# EAGLE design GTOledscapeV0.4 (EAGLE 8.0.0)
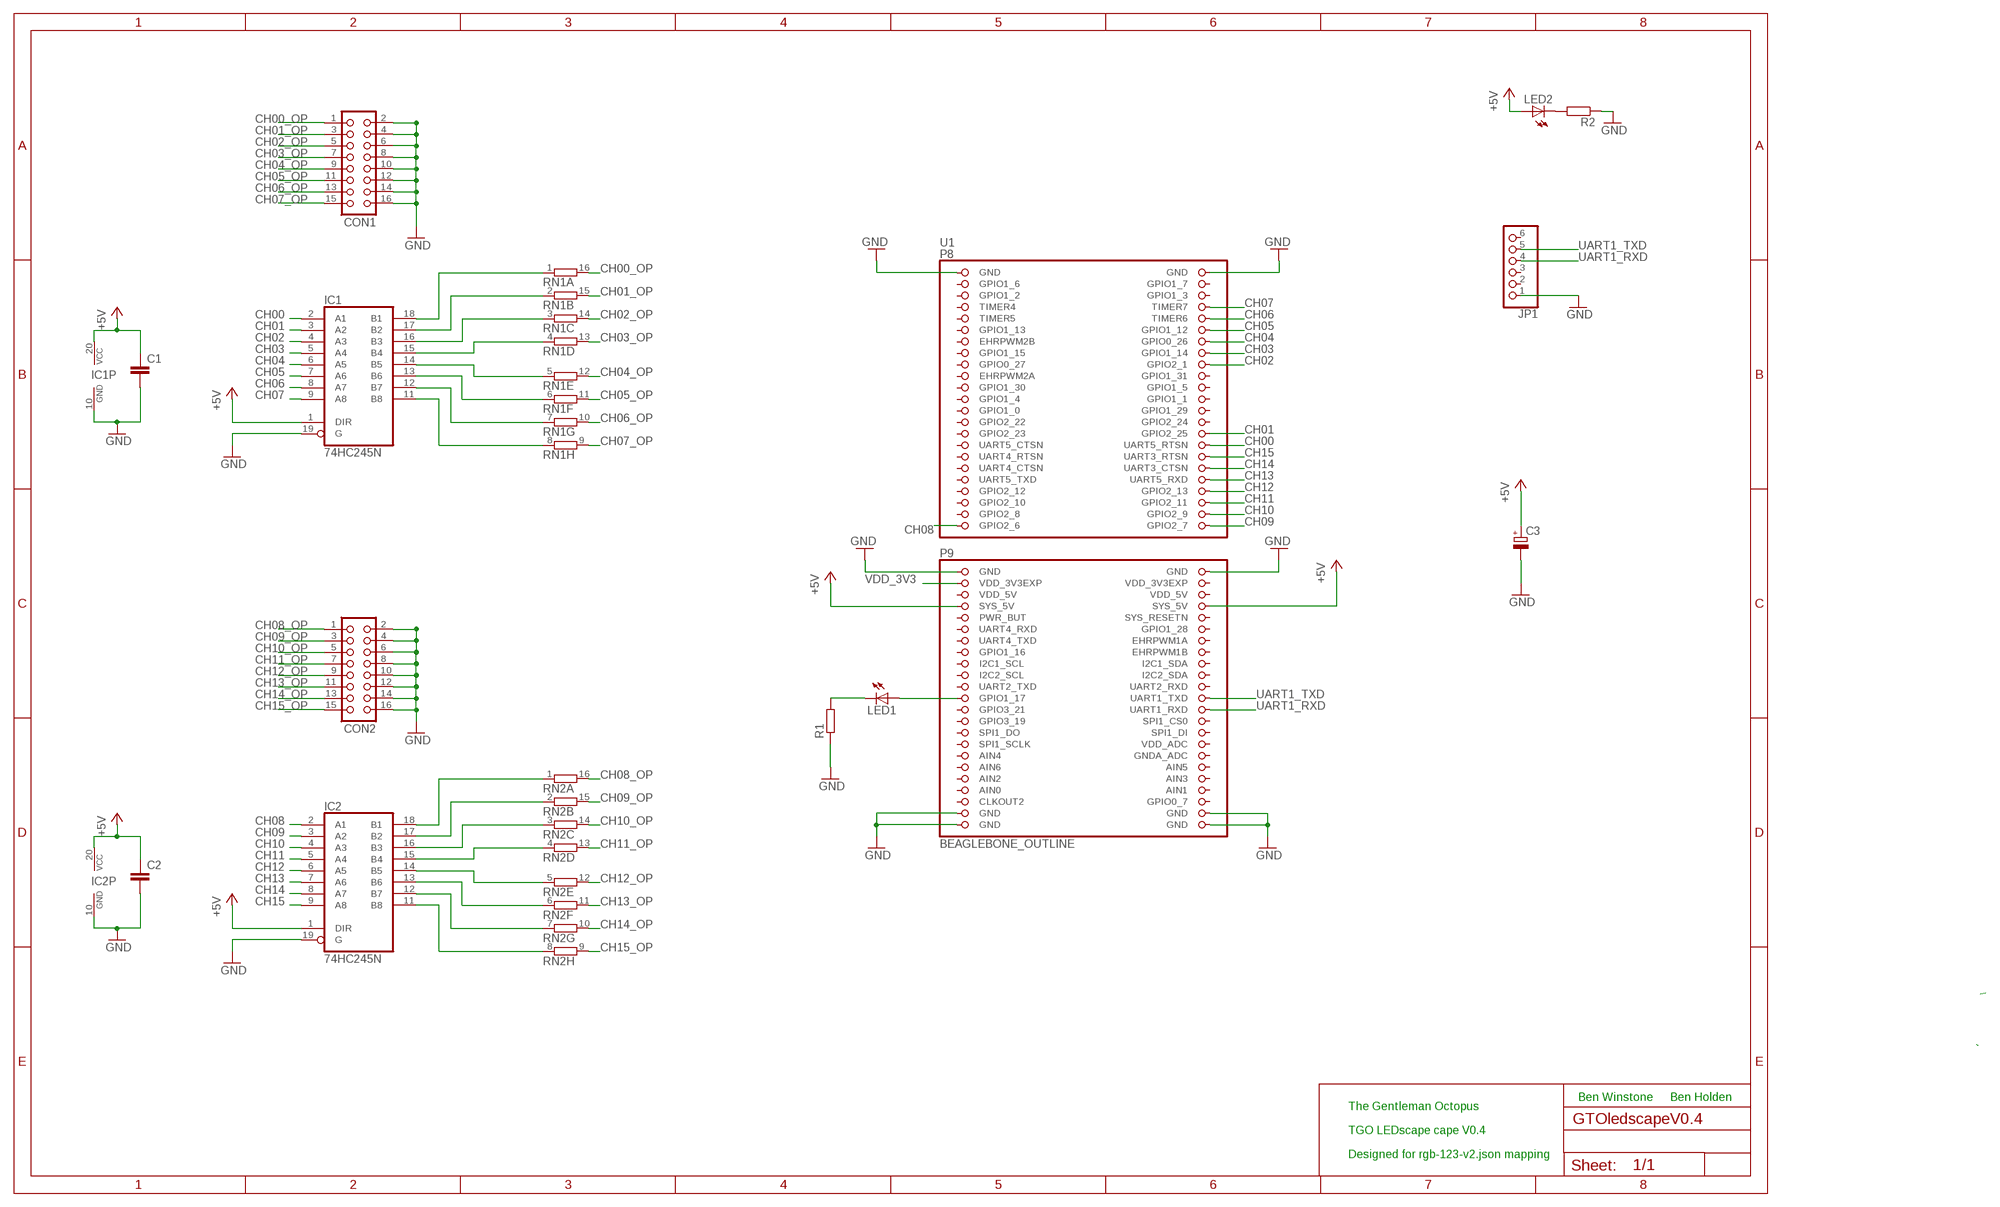
[diagram p0: schematic, sheet 1]

## Parts
C1  C-EU050-045X075  [C050-045X075]
C2  C-EU050-045X075  [C050-045X075]
C3  CPOL-EUE2.5-7  [E2,5-7]
CON1  CON16  [CON16]
CON2  CON16  [CON16]
IC1  74HC245N  [DIL20]
IC2  74HC245N  [DIL20]
JP1  PINHD-1X6  [1X06]
LED1  LED3MM  [LED3MM]
LED2  LED3MM  [LED3MM]
R1  R-EU_0204/5  [0204/5]
R2  R-EU_0204/5  [0204/5]
RN1  8R-N  [DIL16]
RN2  8R-N  [DIL16]
U1  BEAGLEBONE_OUTLINE  [BEAGLEBONE_SHIELD]

## Nets
+5V: C1.1 C2.1 C3.+ IC1.1(DIR) IC1.20(VCC) IC2.1(DIR) IC2.20(VCC) LED2.A U1.53(SYS_5V) U1.54(SYS_5V)
CH00: IC1.2(A1) U1.32(UART5_RTSN)
CH00_OP: CON1.1 RN1.16
CH01: IC1.3(A2) U1.30(GPIO2_25)
CH01_OP: CON1.3 RN1.15
CH02: IC1.4(A3) U1.18(GPIO2_1)
CH02_OP: CON1.5 RN1.14
CH03: IC1.5(A4) U1.16(GPIO1_14)
CH03_OP: CON1.7 RN1.13
CH04: IC1.6(A5) U1.14(GPIO0_26)
CH04_OP: CON1.9 RN1.12
CH05: IC1.7(A6) U1.12(GPIO1_12)
CH05_OP: CON1.11 RN1.11
CH06: IC1.8(A7) U1.10(TIMER6)
CH06_OP: CON1.13 RN1.10
CH07: IC1.9(A8) U1.8(TIMER7)
CH07_OP: CON1.15 RN1.9
CH08: IC2.2(A1) U1.45(GPIO2_6)
CH08_OP: CON2.1 RN2.16
CH09: IC2.3(A2) U1.46(GPIO2_7)
CH09_OP: CON2.3 RN2.15
CH10: IC2.4(A3) U1.44(GPIO2_9)
CH10_OP: CON2.5 RN2.14
CH11: IC2.5(A4) U1.42(GPIO2_11)
CH11_OP: CON2.7 RN2.13
CH12: IC2.6(A5) U1.40(GPIO2_13)
CH12_OP: CON2.9 RN2.12
CH13: IC2.7(A6) U1.38(UART5_RXD)
CH13_OP: CON2.11 RN2.11
CH14: IC2.8(A7) U1.36(UART3_CTSN)
CH14_OP: CON2.13 RN2.10
CH15: IC2.9(A8) U1.34(UART3_RTSN)
CH15_OP: CON2.15 RN2.9
GND: C1.2 C2.2 C3.- CON1.2 CON1.4 CON1.6 CON1.8 CON1.10 CON1.12 CON1.14 CON1.16 CON2.2 CON2.4 CON2.6 CON2.8 CON2.10 CON2.12 CON2.14 CON2.16 IC1.10(GND) IC1.19(G) IC2.10(GND) IC2.19(G) JP1.1 R1.1 R2.1 U1.1(GND) U1.2(GND) U1.47(GND) U1.48(GND) U1.89(GND) U1.90(GND) U1.91(GND) U1.92(GND)
N$1: IC2.18(B1) RN2.1
N$2: LED2.K(C) R2.2
N$3: LED1.K(C) R1.2
N$4: LED1.A U1.69(GPIO1_17)
N$6: IC2.17(B2) RN2.2
N$7: IC1.18(B1) RN1.1
N$10: IC1.17(B2) RN1.2
N$11: IC1.16(B3) RN1.3
N$12: IC1.15(B4) RN1.4
N$13: IC1.14(B5) RN1.5
N$14: IC1.13(B6) RN1.6
N$15: IC2.16(B3) RN2.3
N$16: IC2.15(B4) RN2.4
N$17: IC2.14(B5) RN2.5
N$18: IC2.13(B6) RN2.6
N$19: IC2.12(B7) RN2.7
N$20: IC2.11(B8) RN2.8
N$29: IC1.12(B7) RN1.7
N$30: IC1.11(B8) RN1.8
UART1_RXD: JP1.4 U1.72(UART1_RXD)
UART1_TXD: JP1.5 U1.70(UART1_TXD)
VDD_3V3: U1.49(VDD_3V3EXP)
Unconnected: JP1.2 JP1.3 JP1.6 U1.3(GPIO1_6) U1.4(GPIO1_7) U1.5(GPIO1_2) U1.6(GPIO1_3) U1.7(TIMER4) U1.9(TIMER5) U1.11(GPIO1_13) U1.13(EHRPWM2B) U1.15(GPIO1_15) U1.17(GPIO0_27) U1.19(EHRPWM2A) U1.20(GPIO1_31) U1.21(GPIO1_30) U1.22(GPIO1_5) U1.23(GPIO1_4) U1.24(GPIO1_1) U1.25(GPIO1_0) U1.26(GPIO1_29) U1.27(GPIO2_22) U1.28(GPIO2_24) U1.29(GPIO2_23) U1.31(UART5_CTSN) U1.33(UART4_RTSN) U1.35(UART4_CTSN) U1.37(UART5_TXD) U1.39(GPIO2_12) U1.41(GPIO2_10) U1.43(GPIO2_8) U1.55(PWR_BUT) U1.56(SYS_RESETN) U1.57(UART4_RXD) U1.58(GPIO1_28) U1.59(UART4_TXD) U1.60(EHRPWM1A) U1.61(GPIO1_16) U1.62(EHRPWM1B) U1.63(I2C1_SCL) U1.64(I2C1_SDA) U1.65(I2C2_SCL) U1.66(I2C2_SDA) U1.67(UART2_TXD) U1.68(UART2_RXD) U1.71(GPIO3_21) U1.73(GPIO3_19) U1.74(SPI1_CS0) U1.75(SPI1_DO) U1.76(SPI1_DI) U1.77(SPI1_SCLK) U1.78(VDD_ADC) U1.79(AIN4) U1.80(GNDA_ADC) U1.81(AIN6) U1.82(AIN5) U1.83(AIN2) U1.84(AIN3) U1.86(AIN1) U1.87(CLKOUT2) U1.88(GPIO0_7)

## Notes on the sheet
- Ben Winstone | Ben Holden
- The Gentleman Octopus
  
  TGO LEDscape cape V0.4
  
  Designed for rgb-123-v2.json mapping

## Power pins joined to a net without a drawn wire
AIN0: U1.85(AIN0)
VDD_3V3EXP: U1.50(VDD_3V3EXP)
VDD_5V: U1.51(VDD_5V) U1.52(VDD_5V)

## Library data of the parts
C1 C2 = rcl:C-EU: CAPACITOR, European symbol
C3 = rcl:CPOL-EU: POLARIZED CAPACITOR, European symbol
CON1 CON2 = con-harting:CON16: CONNECTOR; OC_FARNELL: unknown; OC_NEWARK: unknown
IC1 IC2 = 74xx-eu:74*245: Octal BUS TRANSCEIVER, 3-state
JP1 = pinhead:PINHD-1X6: PIN HEADER
LED1 LED2 = led:LED: LED OSRAM: - CHIPLED LG R971, LG N971, LY N971, LG Q971, LY Q971, LO R971, LY R971 LH N974, LH R974 LS Q976, LO Q976, LY Q976 LO Q996 - Hyper CHIPLED LW Q18S LB Q993, LB Q99A, LB R99A - SideLED LS A670, LO A670, LY A670, LG A670, LP A670 LB A673, LV A673, LT A673, LW A673 LH A674 LY A675 LS A676, LA A676, LO A676, LY A676, LW A676 LS A679, LY A679, LG A679 - Hyper Micro SIDELED® LS Y876, LA Y876, LO Y876, LY Y876 LT Y87S - SmartLED LW L88C, LW L88S LB L89C, LB L89S, LG L890 LS L89K, LO L89K, LY L89K LS L896, LA L896, LO L896, LY L896 - TOPLED LS T670, LO T670, LY T670, LG T670, LP T670 LSG T670, LSP T670, LSY T670, LOP T670, LYG T670 LG T671, LOG T671, LSG T671 LB T673, LV T673, LT T673, LW T673 LH T674 LS T676, LA T676, LO T676, LY T676, LB T676, LH T676, LSB T676, LW T676 LB T67C, LV T67C, LT T67C, LS T67K, LO T67K, LY T67K, LW E67C LS E67B, LA E67B, LO E67B, LY E67B, LB E67C, LV E67C, LT E67C LW T67C LS T679, LY T679, LG T679 LS T770, LO T770, LY T770, LG T770, LP T770 LB T773, LV T773, LT T773, LW T773 LH T774 LS E675, LA E675, LY E675, LS T675 LS T776, LA T776, LO T776, LY T776, LB T776 LHGB T686 LT T68C, LB T68C - Hyper Mini TOPLED® LB M676 - Mini TOPLED Santana® LG M470 LS M47K, LO M47K, LY M47K Source: http://www.osram.convergy.de LUXEON: - LUMILED® LXK2-PW12-R00, LXK2-PW12-S00, LXK2-PW14-U00, LXK2-PW14-V00 LXK2-PM12-R00, LXK2-PM12-S00, LXK2-PM14-U00 LXK2-PE12-Q00, LXK2-PE12-R00, LXK2-PE12-S00, LXK2-PE14-T00, LXK2-PE14-U00 LXK2-PB12-K00, LXK2-PB12-L00, LXK2-PB12-M00, LXK2-PB14-N00, LXK2-PB14-P00, LXK2-PB14-Q00 LXK2-PR12-L00, LXK2-PR12-M00, LXK2-PR14-Q00, LXK2-PR14-R00 LXK2-PD12-Q00, LXK2-PD12-R00, LXK2-PD12-S00 LXK2-PH12-R00, LXK2-PH12-S00 LXK2-PL12-P00, LXK2-PL12-Q00, LXK2-PL12-R00 Source: www.luxeon.com KINGBRIGHT: KA-3528ASYC Source: www.kingbright.com
R1 R2 = rcl:R-EU_: RESISTOR, European symbol
RN1 RN2 = resistor-dil:8R-N: DIL RESISTOR; OC_FARNELL: unknown; OC_NEWARK: unknown
U1 = adafruit:BEAGLEBONE_OUTLINE: Should match A3 pinout - but not completely tested

## Board
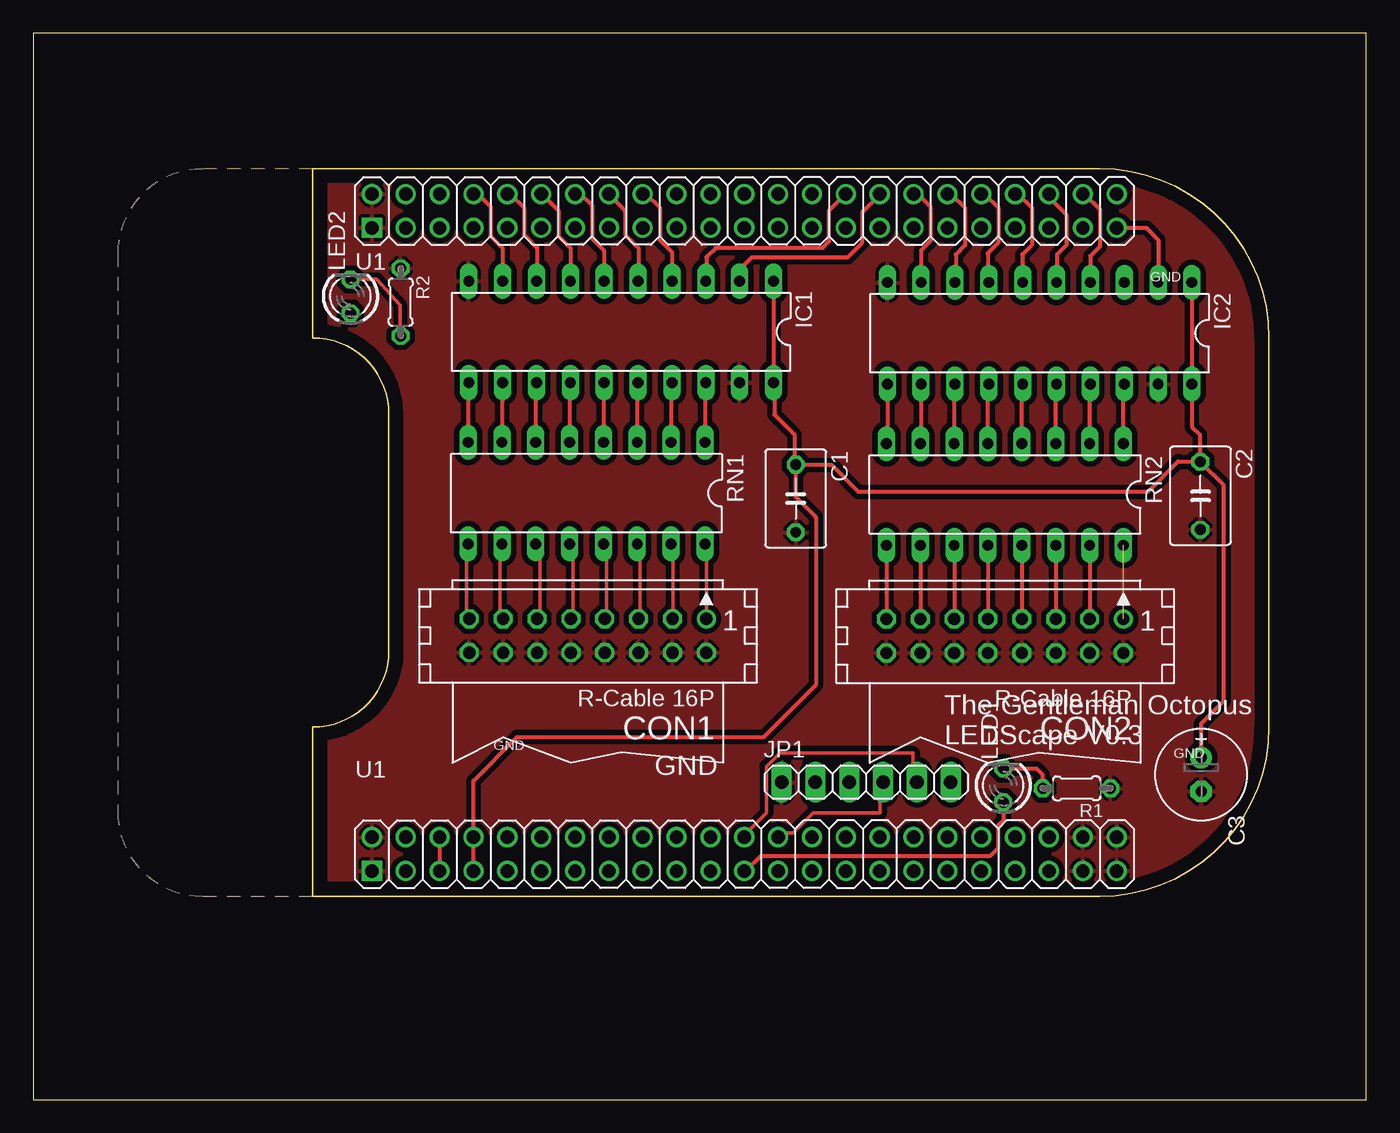
[diagram p1: board, top side]
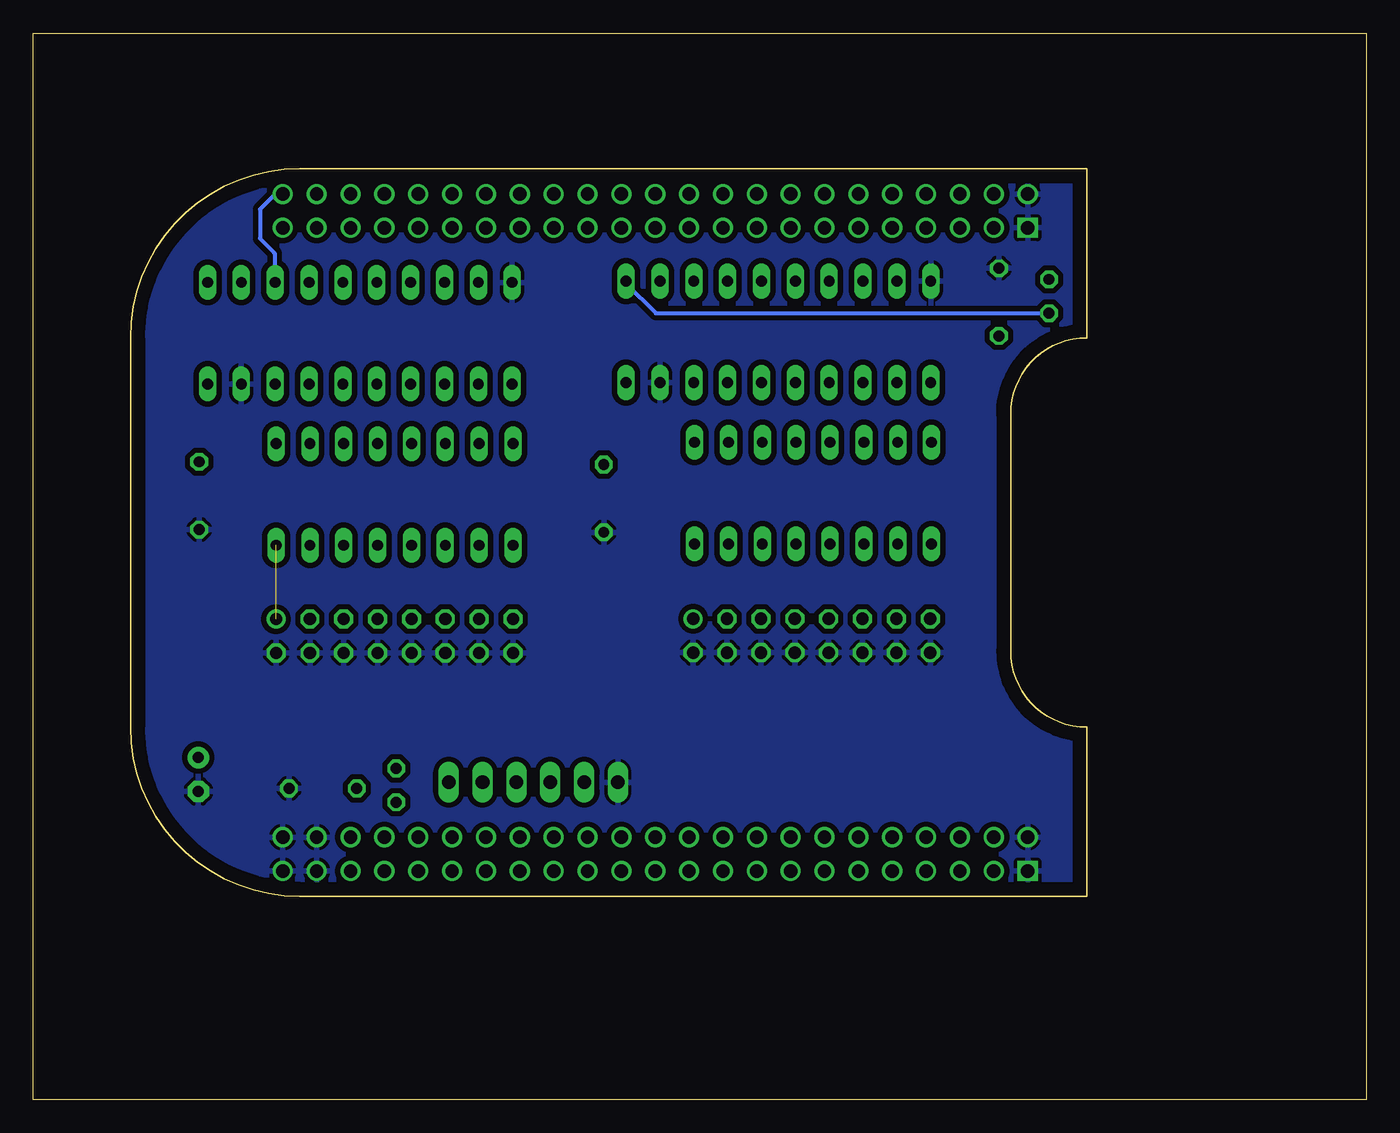
[diagram p2: board, bottom side, seen from below]

Size 100 x 80 mm. Coordinates in mm from the lower left corner, seen from the top.
Outline: 0,0 100,0 100,80 0,80 0,0
Copper layers (1*16): Top 0.035mm / dielectric 1.5mm / Bottom 0.035mm
Design rules "default *": minimum track width 10mil, minimum drill 24mil, track to track 0.2mm, track to pad 8mil, pad to pad 8mil, via to via 8mil, smd to smd 8mil, copper to edge 40mil, drill to drill 8mil, minimum pad ring 10mil, minimum via ring 8mil, stop-mask expansion 4mil, vias tented up to drill 0mil, thermal gap 10mil

### Footprints (pad centres in the part's own frame; a part is rotated, then mirrored left to right if it is on the bottom)
C050-045X075 = drill 0.813 octagon: 1 -2.54,0; 2 2.54,0
E2,5-7 = drill 0.813 pad 1.6: + -1.27,0 | drill 0.813 pad 1.6 octagon: - 1.27,0
CON16 = drill 0.914: 1 -8.89,-1.27 | drill 0.914 octagon: 2 -8.89,1.27; 3 -6.35,-1.27; 4 -6.35,1.27; 5 -3.81,-1.27; 6 -3.81,1.27; 7 -1.27,-1.27; 8 -1.27,1.27; 9 1.27,-1.27; 10 1.27,1.27; 11 3.81,-1.27; 12 3.81,1.27; 13 6.35,-1.27; 14 6.35,1.27; 15 8.89,-1.27; 16 8.89,1.27
DIL20 = drill 0.813 long: 1 -11.43,-3.81; 2 -8.89,-3.81; 3 -6.35,-3.81; 4 -3.81,-3.81; 5 -1.27,-3.81; 6 1.27,-3.81; 7 3.81,-3.81; 8 6.35,-3.81; 9 8.89,-3.81; 10 11.43,-3.81; 11 11.43,3.81; 12 8.89,3.81; 13 6.35,3.81; 14 3.81,3.81; 15 1.27,3.81; 16 -1.27,3.81; 17 -3.81,3.81; 18 -6.35,3.81; 19 -8.89,3.81; 20 -11.43,3.81
1X06 = drill 1.016 long: 1 -6.35,0; 2 -3.81,0; 3 -1.27,0; 4 1.27,0; 5 3.81,0; 6 6.35,0
LED3MM = drill 0.813 octagon: A -1.27,0; K 1.27,0
0204/5 = drill 0.813 octagon: 1 -2.54,0; 2 2.54,0
DIL16 = drill 0.813 long: 1 -8.89,-3.81; 2 -6.35,-3.81; 3 -3.81,-3.81; 4 -1.27,-3.81; 5 1.27,-3.81; 6 3.81,-3.81; 7 6.35,-3.81; 8 8.89,-3.81; 9 8.89,3.81; 10 6.35,3.81; 11 3.81,3.81; 12 1.27,3.81; 13 -1.27,3.81; 14 -3.81,3.81; 15 -6.35,3.81; 16 -8.89,3.81
BEAGLEBONE_SHIELD = drill 1 square: 1 4.445,19.05; 47 52.705,19.05 | drill 1: 2 1.905,19.05; 3 4.445,21.59; 4 1.905,21.59; 5 4.445,24.13; 6 1.905,24.13; 7 4.445,26.67; 8 1.905,26.67; 9 4.445,29.21; 10 1.905,29.21; 11 4.445,31.75; 12 1.905,31.75; 13 4.445,34.29; 14 1.905,34.29; 15 4.445,36.83; 16 1.905,36.83; 17 4.445,39.37; 18 1.905,39.37; 19 4.445,41.91; 20 1.905,41.91; 21 4.445,44.45; 22 1.905,44.45; 23 4.445,46.99; 24 1.905,46.99; 25 4.445,49.53; 26 1.905,49.53; 27 4.445,52.07; 28 1.905,52.07; 29 4.445,54.61; 30 1.905,54.61; 31 4.445,57.15; 32 1.905,57.15; 33 4.445,59.69; 34 1.905,59.69; 35 4.445,62.23; 36 1.905,62.23; 37 4.445,64.77; 38 1.905,64.77; 39 4.445,67.31; 40 1.905,67.31; 41 4.445,69.85; 42 1.905,69.85; 43 4.445,72.39; 44 1.905,72.39; 45 4.445,74.93; 46 1.905,74.93; 48 50.165,19.05; 49 52.705,21.59; 50 50.165,21.59; 51 52.705,24.13; 52 50.165,24.13; 53 52.705,26.67; 54 50.165,26.67; 55 52.705,29.21; 56 50.165,29.21; 57 52.705,31.75; 58 50.165,31.75; 59 52.705,34.29; 60 50.165,34.29; 61 52.705,36.83; 62 50.165,36.83; 63 52.705,39.37; 64 50.165,39.37; 65 52.705,41.91; 66 50.165,41.91; 67 52.705,44.45; 68 50.165,44.45; 69 52.705,46.99; 70 50.165,46.99; 71 52.705,49.53; 72 50.165,49.53; 73 52.705,52.07; 74 50.165,52.07; 75 52.705,54.61; 76 50.165,54.61; 77 52.705,57.15; 78 50.165,57.15; 79 52.705,59.69; 80 50.165,59.69; 81 52.705,62.23; 82 50.165,62.23; 83 52.705,64.77; 84 50.165,64.77; 85 52.705,67.31; 86 50.165,67.31; 87 52.705,69.85; 88 50.165,69.85; 89 52.705,72.39; 90 50.165,72.39; 91 52.705,74.93; 92 50.165,74.93

### Placement (x,y rotation side)
C1  57.2,45.1 270 top
C2  87.56,45.3 270 top
C3  87.62,24.39 270 top
CON1  41.6,34.8 180 top
CON2  72.9,34.78 180 top
IC1  44.1,57.6 180 top
IC2  75.5,57.5 180 top
JP1  62.49,23.81 0 top
LED1  72.78,23.57 90 top
LED2  23.8,60.27 90 top
R1  78.27,23.35 180 top
R2  27.56,59.83 270 top
RN1  41.5,45.5 180 top
RN2  72.9,45.4 180 top
U1  6.35,69.85 270 top

### Tracks (layer width: path | path; a pad name or v marks a point on that pad's centre or on a via)
+5V
  Top 0.3: C1.1 57.1,47.74 57.1,49.9 55.6,51.4 55.6,53.79 IC1.20 IC1.1 | IC2.1 IC2.20 86.93,50.47 87.5,49.9 87.5,47.9 C2.1 | C2.1 89.3,46.1 89.3,29.9 87.6,28.2 87.6,25.68 C3.+ 87.62,26.32 | U1.53 U1.54 33.02,23.92 36.3,27.2 54.8,27.2 58.7,31.1 58.7,43.7 57.2,45.2 C1.1 | C2.1 85.96,47.84 85.9,47.9 83.6,45.6 61.9,45.6 59.9,47.6 57.24,47.6 C1.1
  Bottom 0.3: LED2.A 52.4,59 53.3,59 55.53,61.23 IC1.1
CH00
  Top 0.3: U1.32 63.5,67.9 62.2,66.6 62.2,64.3 61.1,63.2 53.9,63.2 53,62.3 IC1.2
CH00_OP
  Top 0.254: RN1.16 50.5,41.5 50.5,36.5 CON1.1
CH01
  Top 0.3: U1.30 61.16,68.16 59.7,66.7 59.7,64.4 59.2,63.9 51.2,63.9 50.5,63.2 50.5,61.46 IC1.3
CH01_OP
  Top 0.254: RN1.15 48,41.5 48,36.5 CON1.3
CH02
  Top 0.3: U1.18 45.95,67.94 47,66.9 47,64.5 47.9,63.6 IC1.4
CH02_OP
  Top 0.254: RN1.14 45.5,41.5 45.5,36.5 CON1.5
CH03
  Top 0.3: U1.16 43.18,67.92 44.4,66.7 44.4,64.9 45.4,63.9 45.4,61.44 IC1.5
CH03_OP
  Top 0.254: RN1.13 43,41.5 43,36.5 CON1.7
CH04
  Top 0.3: U1.14 41.05,67.94 41.9,67.1 41.9,64.6 42.8,63.7 42.8,61.44 IC1.6
CH04_OP
  Top 0.254: RN1.12 40.5,41.5 40.5,36.5 CON1.9
CH05
  Top 0.3: U1.12 38.16,67.94 39.4,66.7 39.4,64.8 40.3,63.9 IC1.7
CH05_OP
  Top 0.254: RN1.11 38,41.5 38,36.5 CON1.11
CH06
  Top 0.3: U1.10 35.76,67.94 36.8,66.9 36.8,64.9 37.8,63.9 37.8,61.46 IC1.8
CH06_OP
  Top 0.254: RN1.10 35,41.5 35,36.5 CON1.13
CH07
  Top 0.3: U1.8 33.35,67.94 34.3,67 34.3,64.8 35.2,63.9 IC1.9
CH07_OP
  Top 0.254: RN1.9 32.5,41.5 32.5,36.5 CON1.15
CH08
  Top 0.3: U1.45 83.5,65.41 84.4,64.5 IC2.2
CH08_OP  (1 unrouted)
CH09
  Bottom 0.3: U1.46 81.86,67.94 83,66.8 83,64.6 81.9,63.5 81.9,61.36 IC2.3
CH09_OP
  Top 0.3: RN2.15 CON2.3
CH10
  Top 0.3: U1.44 78.86,67.94 80,66.8 80,64 79.3,63.3 IC2.4
CH10_OP
  Top 0.3: RN2.14 CON2.5
CH11
  Top 0.3: U1.42 76.2,67.7 77.5,66.4 77.5,64.1 76.8,63.4 76.8,61.34 IC2.5
CH11_OP
  Top 0.3: RN2.13 CON2.7
CH12
  Top 0.3: U1.40 73.86,67.94 74.9,66.9 74.9,64.1 74.2,63.4 74.2,61.34 IC2.6
CH12_OP
  Top 0.3: RN2.12 CON2.9
CH13
  Top 0.3: U1.38 71.36,67.94 72.4,66.9 72.4,64.3 71.6,63.5 71.6,61.4 IC2.7
CH13_OP
  Top 0.3: RN2.11 CON2.11
CH14
  Top 0.3: U1.36 68.86,67.94 69.9,66.9 69.9,64.1 69.2,63.4 69.2,61.36 IC2.8
CH14_OP
  Top 0.3: RN2.10 CON2.13
CH15
  Top 0.3: U1.34 66.36,67.94 67.3,67 67.3,64.4 | 67.3,64.4 67.2,64.3 | 67.3,64.4 66.6,63.7 IC2.9
CH15_OP
  Top 0.3: RN2.9 CON2.15
GND
  pour Bottom (isolate 0.4): 5.08,72.39 95.25,72.39 95.25,12.7 5.08,12.7
  pour Top (isolate 0.4): 10.8,71.9 96.4,71.9 96.4,14 90.5,14 90.5,13.4 17.7,13.4 17.7,71.8 10.8,71.8
N$1
  Top 0.3: RN2.1 81.79,53.63 IC2.18
N$2
  Top 0.254: LED2.K 25.76,61.54 27.5,59.6 27.5,57.63 R2.2
N$3
  Top 0.3: LED1.K 75.26,24.84 75.7,24.4 75.7,23.38 R1.2
N$4
  Top 0.3: U1.69 53.45,17.14 54.6,18.3 71.8,18.3 72.4,18.9 72.4,20.6 72.8,21 72.8,22.28 LED1.A
N$6
  Top 0.3: RN2.2 79.25,53.63 IC2.17
N$7
  Top 0.3: IC1.18 50.39,53.79 RN1.1
N$10
  Top 0.3: IC1.17 47.85,53.79 RN1.2
N$11
  Top 0.3: IC1.16 45.31,53.79 RN1.3
N$12
  Top 0.3: IC1.15 42.77,53.79 RN1.4
N$13
  Top 0.3: IC1.14 40.23,53.79 RN1.5
N$14
  Top 0.3: IC1.13 37.69,53.79 RN1.6
N$15
  Top 0.3: RN2.3 76.71,53.63 IC2.16
N$16
  Top 0.3: RN2.4 74.17,53.63 IC2.15
N$17
  Top 0.3: RN2.5 71.63,53.63 IC2.14
N$18
  Top 0.3: RN2.6 69.09,53.63 IC2.13
N$19
  Top 0.3: IC2.12 66.61,49.27 RN2.7
N$20
  Top 0.3: IC2.11 64.07,49.27 RN2.8
N$29
  Top 0.3: IC1.12 35.15,53.79 RN1.7
N$30
  Top 0.3: IC1.11 32.61,53.79 RN1.8
UART1_RXD
  Top 0.254: U1.72 56,20 57,20 58.5,21.5 63.5,21.5 63.5,23.5 JP1.4
UART1_TXD
  Top 0.254: U1.70 53.5,20 55,21.5 55,25 56,26 66,26 66,24 JP1.5
VDD_5V
  Top 0.3: U1.52 U1.51

### Text on the board
tPlace: GND | The Gentleman Octopus / LEDScape V0.3 | GND | GND | GND